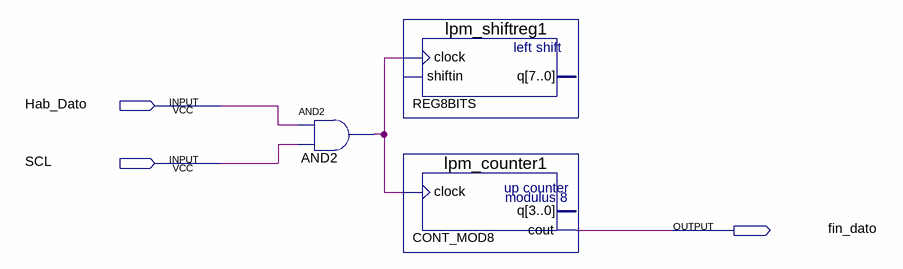
[diagram p0: schematic sheet]
// Quartus schematic bloque_b.bdf as structural Verilog: 3 symbols, 3 pins
module bloque_b (
  input  Hab_Dato,
  input  SCL,
  output fin_dato
);

  wire AND2_out;

  and AND2 (AND2_out, Hab_Dato, SCL);
  lpm_shiftreg1 REG8BITS (.clock(AND2_out));  // open: shiftin, q
  lpm_counter1 CONT_MOD8 (.clock(AND2_out), .cout(fin_dato));  // open: q
endmodule
